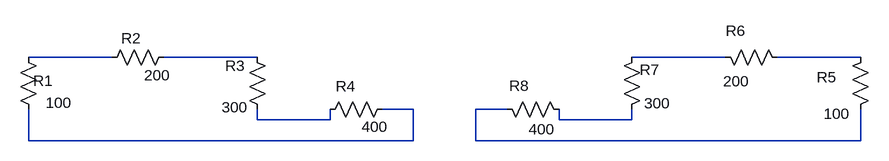
[diagram p0: schematic 03- Resistors and wires Mirrored and custom text placement.asc]
03- Resistors and wires Mirrored and custom text placement.asc, the LTspice schematic file:
Version 4.1
SHEET 1 1392 680
WIRE 224 128 96 128
WIRE 448 128 304 128
WIRE 1168 128 1024 128
WIRE 1376 128 1248 128
WIRE 688 208 640 208
WIRE 832 208 784 208
WIRE 448 224 448 208
WIRE 560 224 560 208
WIRE 560 224 448 224
WIRE 912 224 912 208
WIRE 1024 224 1024 208
WIRE 1024 224 912 224
WIRE 96 256 96 208
WIRE 688 256 688 208
WIRE 688 256 96 256
WIRE 784 256 784 208
WIRE 1376 256 1376 208
WIRE 1376 256 784 256
SYMBOL res 80 112 R0
WINDOW 0 23 52 Left 2
WINDOW 3 42 86 Left 2
SYMATTR InstName R1
SYMATTR Value 100
SYMBOL res 320 112 R90
WINDOW 0 2 66 VBottom 2
WINDOW 3 28 26 VTop 2
SYMATTR InstName R2
SYMATTR Value 200
SYMBOL res 464 224 R180
WINDOW 0 35 83 Left 2
WINDOW 3 30 19 Left 2
SYMATTR InstName R3
SYMATTR Value 300
SYMBOL res 544 224 R270
WINDOW 0 36 40 VTop 2
WINDOW 3 5 85 VBottom 2
SYMATTR InstName R4
SYMATTR Value 400
SYMBOL res 1392 112 M0
WINDOW 0 53 47 Left 2
WINDOW 3 32 103 Left 2
SYMATTR InstName R5
SYMATTR Value 100
SYMBOL res 1152 112 M90
WINDOW 0 -9 32 VBottom 2
WINDOW 3 37 33 VTop 2
SYMATTR InstName R6
SYMATTR Value 200
SYMBOL res 1008 224 M180
WINDOW 0 28 77 Left 2
WINDOW 3 35 25 Left 2
SYMATTR InstName R7
SYMATTR Value 300
SYMBOL res 928 224 M270
WINDOW 0 37 77 VTop 2
WINDOW 3 1 42 VBottom 2
SYMATTR InstName R8
SYMATTR Value 400

The netlist it stands for:
* 03- Resistors and wires Mirrored and custom text placement.asc
R1 N001 N005 100
R2 N002 N001 200
R3 N007 N002 300
R4 N007 N005 400
R5 N004 N006 100
R6 N003 N004 200
R7 N008 N003 300
R8 N008 N006 400
.backanno
.end